# EAGLE design esp32 (EAGLE 9.6.2)

## Sheet 1 of 3: ESP32 asd
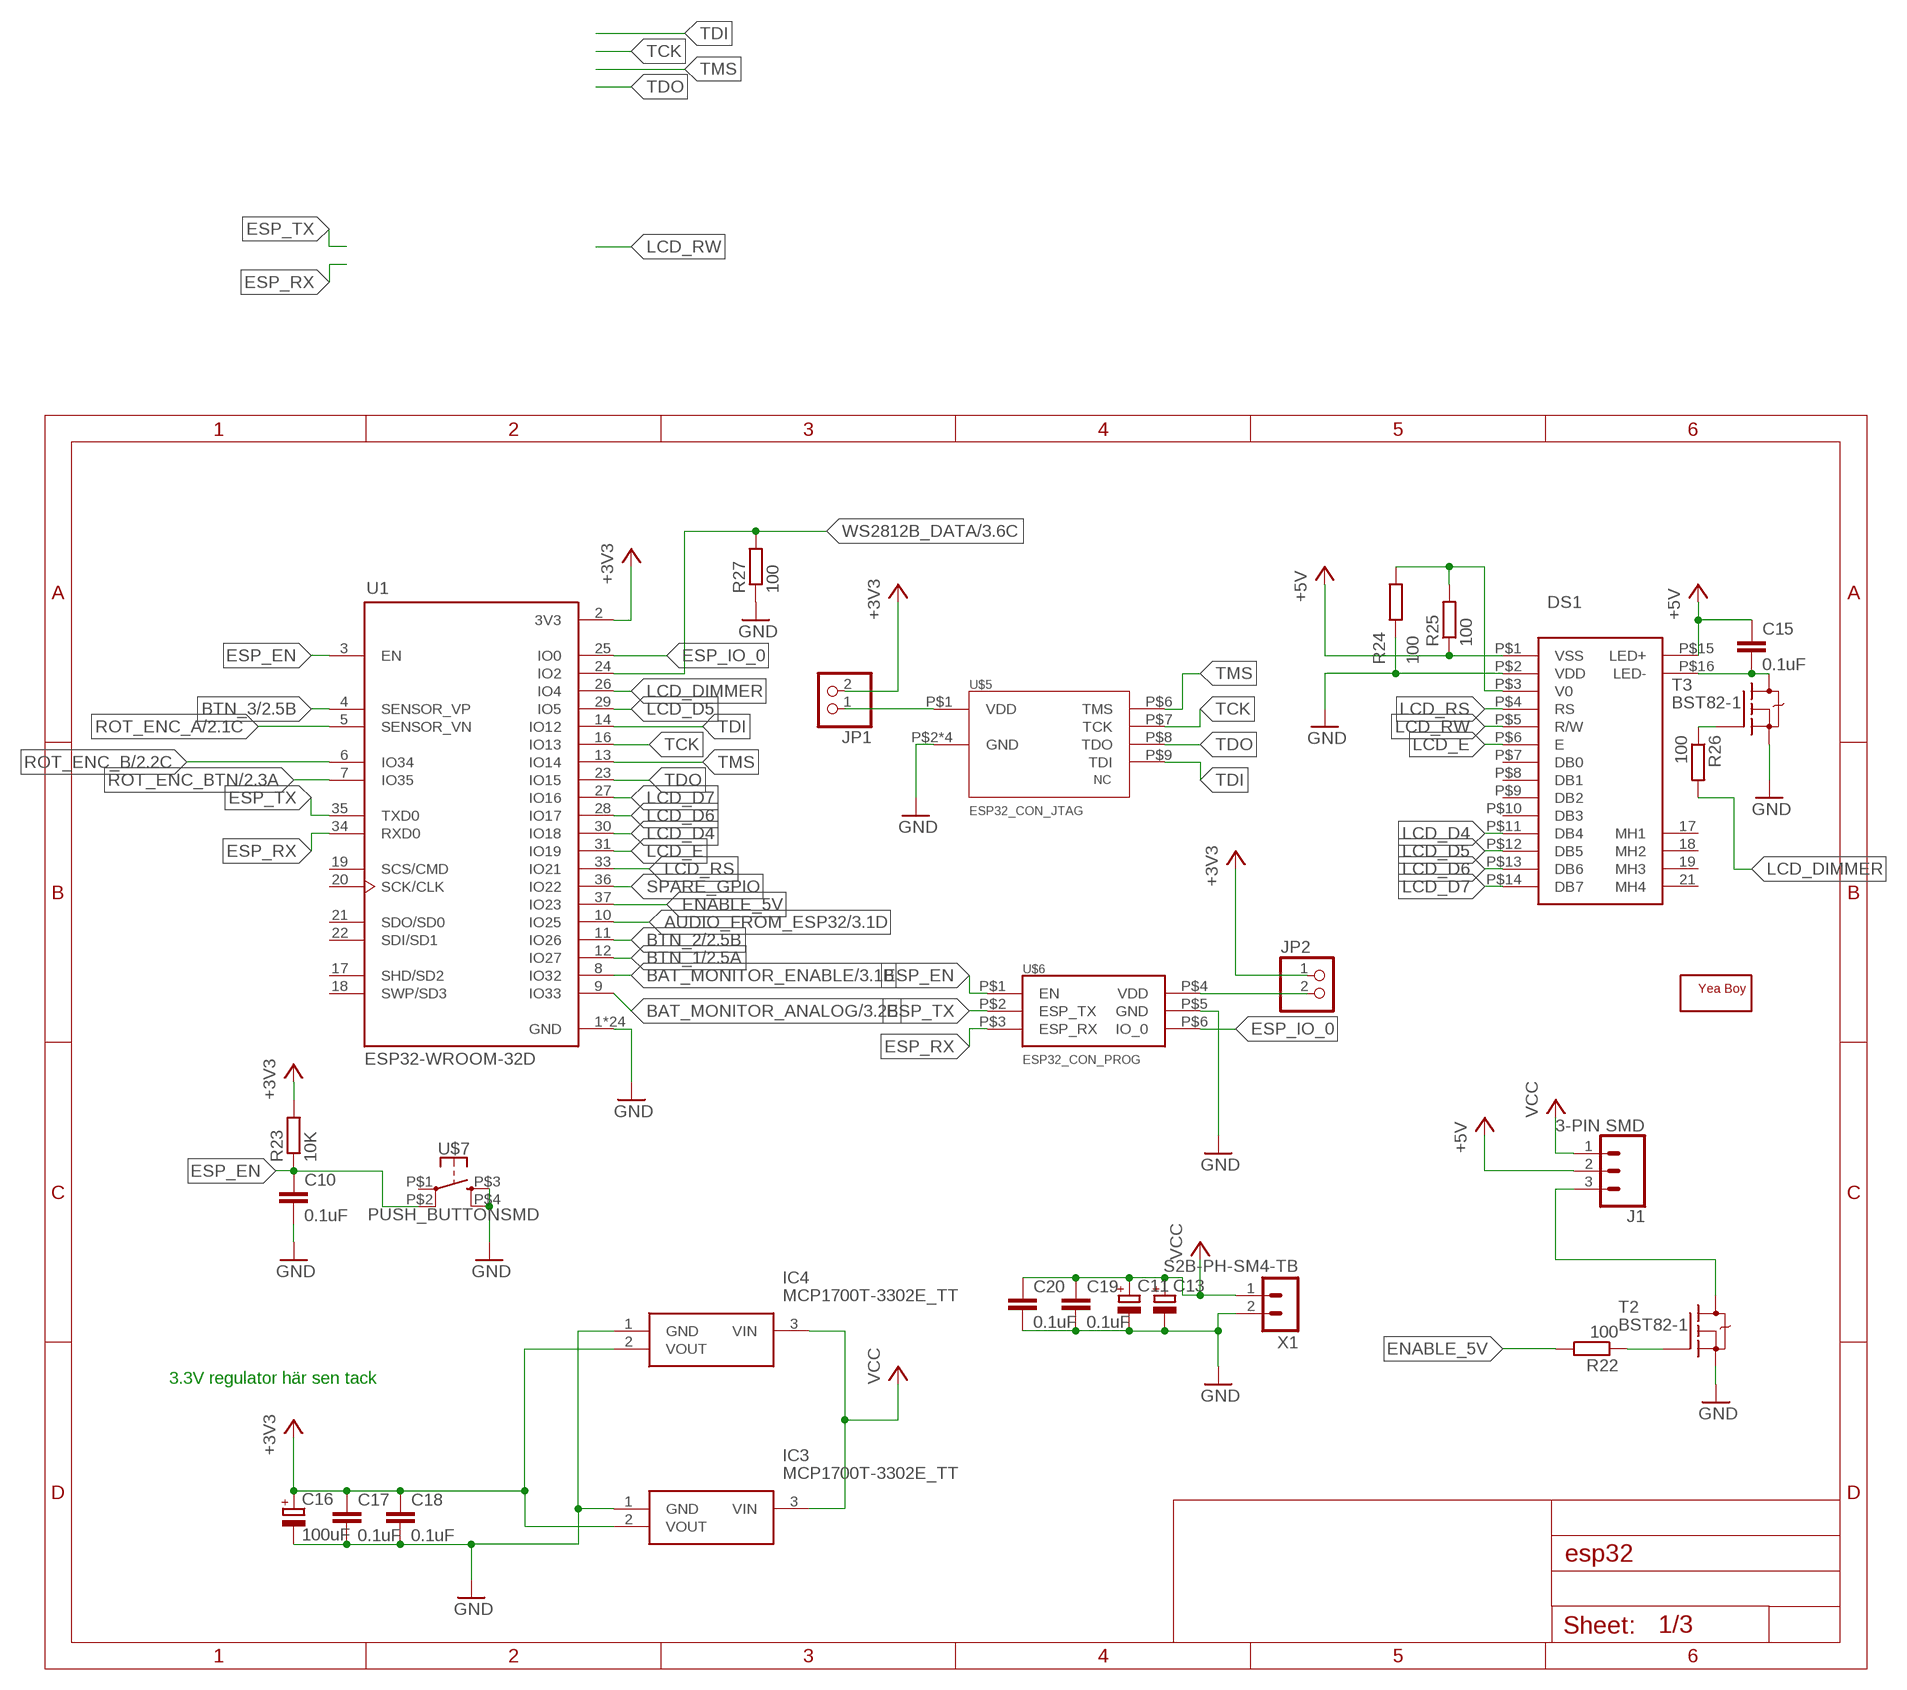
[diagram p0: schematic, sheet 1]

### Parts
C10  0.1uF  C-EUC0603  [C0603]
C11  CPOL-EU153CLV-0605  [153CLV-0605]
C13  CPOL-EU153CLV-0505  [153CLV-0505]
C15  0.1uF  C-EUC0603  [C0603]
C16  100uF  CPOL-EU153CLV-0605  [153CLV-0605]
C17  0.1uF  C-EUC0603  [C0603]
C18  0.1uF  C-EUC0603  [C0603]
C19  0.1uF  C-EUC0603  [C0603]
C20  0.1uF  C-EUC0603  [C0603]
DS1  NHD-0216XZ-FSW-GBWSMT  [NHD0216XZFSWGBW_SMT]
IC3  MCP1700T-3302E_TT  [SOT95P237X112-3N]
IC4  MCP1700T-3302E_TT  [SOT95P237X112-3N]
J1  3-PIN SMD  CONN_03JST-SMD  [JST-3-SMD]
JP1  PINHD-1X2  [1X02]
JP2  PINHD-1X2  [1X02]
R22  100  R-EU_R0603  [R0603]
R23  10K  R-EU_R0603  [R0603]
R24  100  R-EU_R0603  [R0603]
R25  100  R-EU_R0603  [R0603]
R26  100  R-EU_R0603  [R0603]
R27  100  R-EU_R0603  [R0603]
T2  BST82-1  [SOT23]
T3  BST82-1  [SOT23]
U1  ESP32-WROOM-32D  [MODULE_ESP32-WROOM-32D]
U$5  ESP32_CON_JTAG  [DC3_10P_0.05]
U$6  ESP32_CON_PROG  [DC3_6P_0.05]
U$7  PUSH_BUTTONSMD  [TACTILE_SWITCH_PTH_6.0MM_SMD]
U$8  TOUCHMARK  [TOUCHMARK]
X1  S2B-PH-SM4-TB  [S2B-PH-SM4-TB]

### Nets
+3V3: C16.+ C17.1 C18.1 IC3.2(VOUT) IC4.2(VOUT) JP1.2 JP2.1 R23.2 U1.2(3V3) ; also sheet 2
+5V: C15.1 DS1.P$1(VSS) DS1.P$15(LED+) J1.2 R25.1 ; also sheet 3
AUDIO_FROM_ESP32: U1.10(IO25) ; also sheet 3
BAT_MONITOR_ANALOG: U1.9(IO33) ; also sheet 3
BAT_MONITOR_ENABLE: U1.8(IO32) ; also sheet 3
BTN_1: U1.12(IO27) ; also sheet 2
BTN_2: U1.11(IO26) ; also sheet 2
BTN_3: U1.4(SENSOR_VP) ; also sheet 2
ENABLE_5V: R22.2 U1.37(IO23)
ESP_EN: C10.1 R23.1 U1.3(EN) U$6.P$1(EN) U$7.P$2
ESP_IO_0: U1.25(IO0) U$6.P$6(IO_0)
ESP_RX: U1.34(RXD0) U$6.P$3(ESP_RX)
ESP_TX: U1.35(TXD0) U$6.P$2(ESP_TX)
GND: C10.2 C11.- C13.- C16.- C17.2 C18.2 C19.2 C20.2 DS1.P$2(VDD) IC3.1(GND) IC4.1(GND) R24.1 R27.1 T2.2(S) T3.2(S) U1.1(GND) U1.15(GND) U1.38(GND) U1.39_1(GND) U1.39_2(GND) U1.39_3(GND) U1.39_4(GND) U1.39_5(GND) U1.39_6(GND) U1.39_7(GND) U1.39_8(GND) U1.39_9(GND) U1.39_10(GND) U1.39_11(GND) U1.39_12(GND) U1.39_13(GND) U1.39_14(GND) U1.39_15(GND) U1.39_16(GND) U1.39_17(GND) U1.39_18(GND) U1.39_19(GND) U1.39_20(GND) U1.39_21(GND) U$5.P$2(GND) U$5.P$3(GND) U$5.P$4(GND) U$5.P$5(GND) U$6.P$5(GND) U$7.P$3 U$7.P$4 X1.2 ; also sheet 2,3
LCD_D4: DS1.P$11(DB4) U1.30(IO18)
LCD_D5: DS1.P$12(DB5) U1.29(IO5)
LCD_D6: DS1.P$13(DB6) U1.28(IO17)
LCD_D7: DS1.P$14(DB7) U1.27(IO16)
LCD_DIMMER: R26.2 U1.26(IO4)
LCD_E: DS1.P$6(E) U1.31(IO19)
LCD_RS: DS1.P$4(RS) U1.33(IO21)
LCD_RW: DS1.P$5(R/W)
N$11: R22.1 T2.1(G)
N$15: J1.3 T2.3(D)
N$16: R26.1 T3.1(G)
N$17: DS1.P$3(V0) R24.2 R25.2
N$18: C15.2 DS1.P$16(LED-) T3.3(D)
N$22: JP2.2 U$6.P$4(VDD)
N$24: JP1.1 U$5.P$1(VDD)
ROT_ENC_A: U1.5(SENSOR_VN) ; also sheet 2
ROT_ENC_B: U1.6(IO34) ; also sheet 2
ROT_ENC_BTN: U1.7(IO35) ; also sheet 2
SPARE_GPIO: U1.36(IO22)
TCK: U1.16(IO13) U$5.P$7(TCK)
TDI: U1.14(IO12) U$5.P$9(TDI)
TDO: U1.23(IO15) U$5.P$8(TDO)
TMS: U1.13(IO14) U$5.P$6(TMS)
VCC: C11.+ C13.+ C19.1 C20.1 IC3.3(VIN) IC4.3(VIN) J1.1 X1.1 ; also sheet 3
WS2812B_DATA: R27.2 U1.24(IO2) ; also sheet 3
Unconnected: DS1.17(MH1) DS1.18(MH2) DS1.19(MH3) DS1.21(MH4) DS1.P$7(DB0) DS1.P$8(DB1) DS1.P$9(DB2) DS1.P$10(DB3) U1.17(SHD/SD2) U1.18(SWP/SD3) U1.19(SCS/CMD) U1.20(SCK/CLK) U1.21(SDO/SD0) U1.22(SDI/SD1) U$7.P$1

### Notes on the sheet
- 3.3V regulator här sen tack

## Sheet 2 of 3: Knappar och rotary encoder
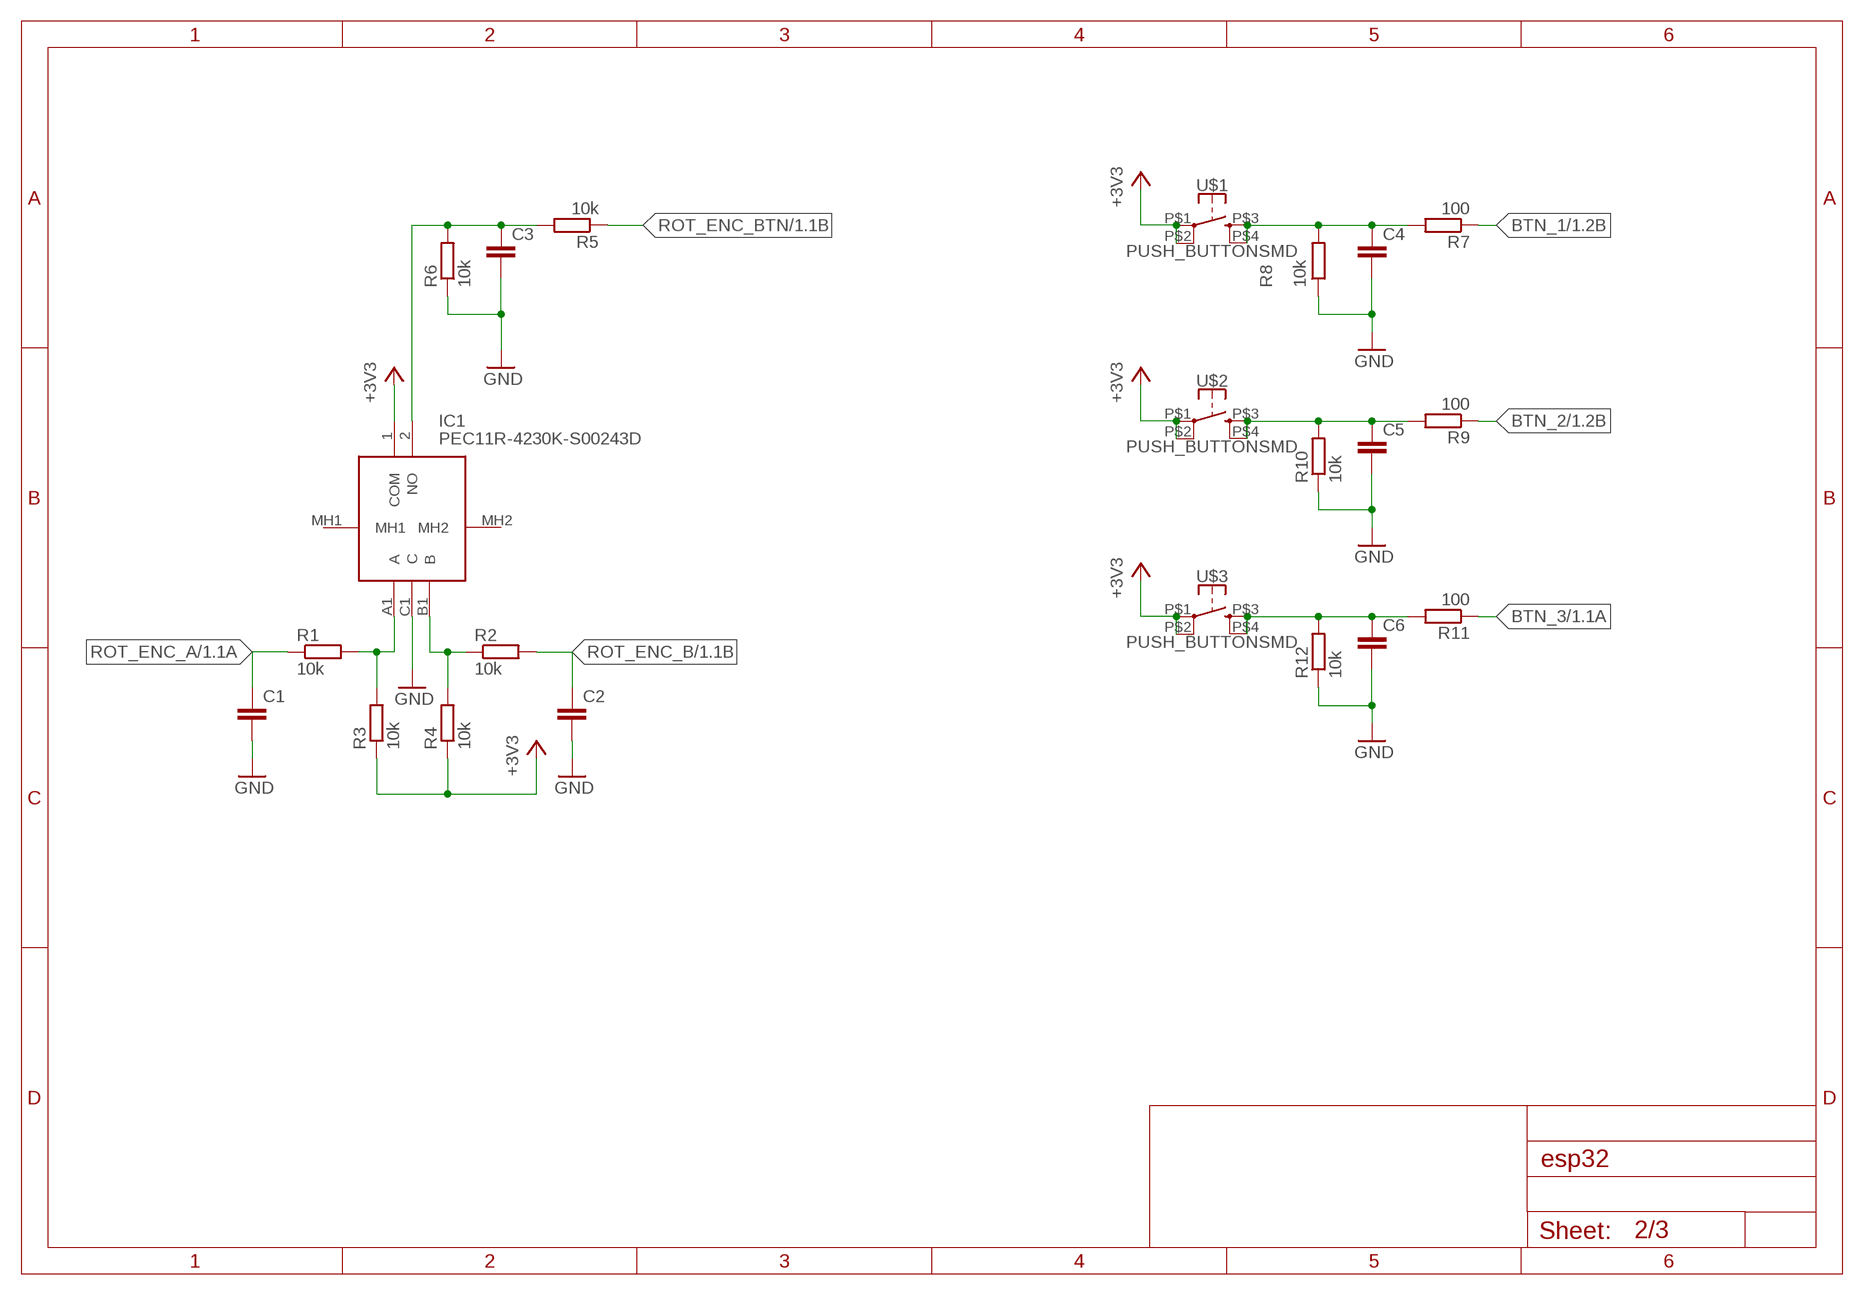
[diagram p1: schematic, sheet 2]

### Parts
C1  C-EUC0603  [C0603]
C2  C-EUC0603  [C0603]
C3  C-EUC0603  [C0603]
C4  C-EUC0603  [C0603]
C5  C-EUC0603  [C0603]
C6  C-EUC0603  [C0603]
IC1  PEC11R-4230K-S00243D  [PEC11R4230KS0024]
R1  10k  R-EU_R0603  [R0603]
R2  10k  R-EU_R0603  [R0603]
R3  10k  R-EU_R0603  [R0603]
R4  10k  R-EU_R0603  [R0603]
R5  10k  R-EU_R0603  [R0603]
R6  10k  R-EU_R0603  [R0603]
R7  100  R-EU_R0603  [R0603]
R8  10k  R-EU_R0603  [R0603]
R9  100  R-EU_R0603  [R0603]
R10  10k  R-EU_R0603  [R0603]
R11  100  R-EU_R0603  [R0603]
R12  10k  R-EU_R0603  [R0603]
U$1  PUSH_BUTTONSMD  [TACTILE_SWITCH_PTH_6.0MM_SMD]
U$2  PUSH_BUTTONSMD  [TACTILE_SWITCH_PTH_6.0MM_SMD]
U$3  PUSH_BUTTONSMD  [TACTILE_SWITCH_PTH_6.0MM_SMD]

### Nets
+3V3: IC1.1(COM) R3.1 R4.1 U$1.P$1 U$1.P$2 U$2.P$1 U$2.P$2 U$3.P$1 U$3.P$2 ; also sheet 1
BTN_1: R7.1 ; also sheet 1
BTN_2: R9.1 ; also sheet 1
BTN_3: R11.1 ; also sheet 1
GND: C1.2 C2.2 C3.2 C4.2 C5.2 C6.2 IC1.C1(C) R6.1 R8.1 R10.1 R12.1 ; also sheet 1,3
N$1: IC1.A1(A) R1.2 R3.2
N$2: IC1.B1(B) R2.1 R4.2
N$3: C4.1 R7.2 R8.2 U$1.P$3 U$1.P$4
N$6: C5.1 R9.2 R10.2 U$2.P$3 U$2.P$4
N$8: C6.1 R11.2 R12.2 U$3.P$3 U$3.P$4
N$9: C3.1 IC1.2(NO) R5.2 R6.2
ROT_ENC_A: C1.1 R1.1 ; also sheet 1
ROT_ENC_B: C2.1 R2.2 ; also sheet 1
ROT_ENC_BTN: R5.1 ; also sheet 1
Unconnected: IC1.MH1 IC1.MH2

## Sheet 3 of 3
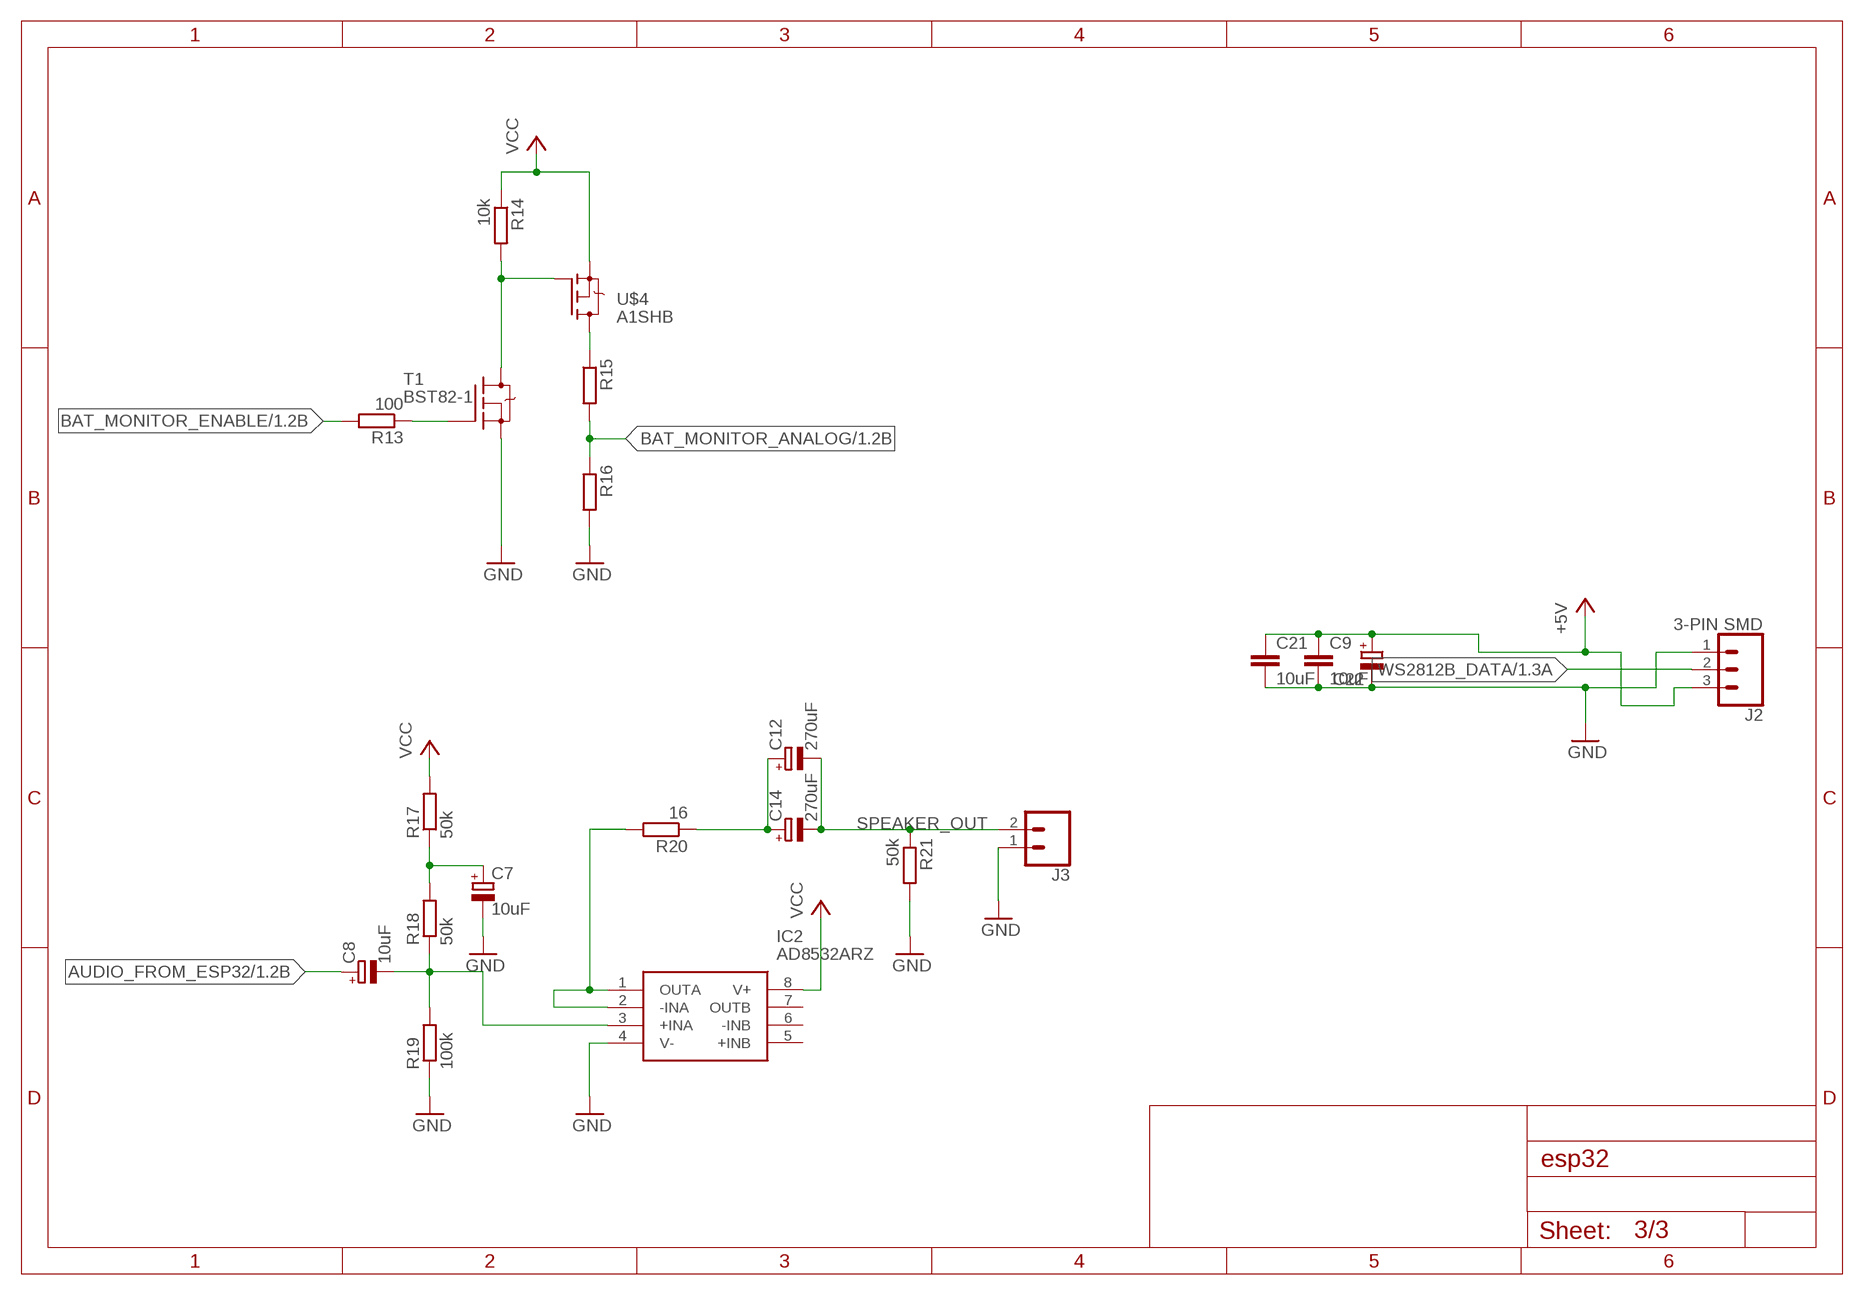
[diagram p2: schematic, sheet 3]

### Parts
C7  10uF  CPOL-EU153CLV-0505  [153CLV-0505]
C8  10uF  CPOL-EU153CLV-0505  [153CLV-0505]
C9  10uF  C-EUC0603  [C0603]
C12  270uF  CPOL-EU153CLV-0605  [153CLV-0605]
C14  270uF  CPOL-EU153CLV-0605  [153CLV-0605]
C21  10uF  C-EUC0603  [C0603]
C22  CPOL-EU153CLV-0605  [153CLV-0605]
IC2  AD8532ARZ  [SOIC127P600X175-8N]
J2  3-PIN SMD  CONN_03JST-SMD  [JST-3-SMD]
J3  CONN_02-JST-2MM-SMT  [JST-2-SMD]
R13  100  R-EU_R0603  [R0603]
R14  10k  R-EU_R0603  [R0603]
R15  R-EU_R0603  [R0603]
R16  R-EU_R0603  [R0603]
R17  50k  R-EU_R0603  [R0603]
R18  50k  R-EU_R0603  [R0603]
R19  100k  R-EU_R0603  [R0603]
R20  16  R-EU_R0603  [R0603]
R21  50k  R-EU_R0603  [R0603]
T1  BST82-1  [SOT23]
U$4  A1SHB  [SOT23]

### Nets
+5V: C9.1 C21.1 C22.+ J2.3 ; also sheet 1
AUDIO_FROM_ESP32: C8.+ ; also sheet 1
BAT_MONITOR_ANALOG: R15.2 R16.1 ; also sheet 1
BAT_MONITOR_ENABLE: R13.2 ; also sheet 1
GND: C7.- C9.2 C21.2 C22.- IC2.4(V-) J2.1 J3.1 R16.2 R19.1 R21.2 T1.2(S) ; also sheet 1,2
N$4: C8.- IC2.3(+INA) R18.1 R19.2
N$5: R15.1 U$4.3(D)
N$7: R14.2 T1.3(D) U$4.1(G)
N$10: C7.+ R17.1 R18.2
N$12: IC2.1(OUTA) IC2.2(-INA) R20.2
N$13: R13.1 T1.1(G)
N$14: C12.+ C14.+ R20.1
SPEAKER_OUT: C12.- C14.- J3.2 R21.1
VCC: IC2.8(V+) R14.1 R17.2 U$4.2(S) ; also sheet 1
WS2812B_DATA: J2.2 ; also sheet 1
Unconnected: IC2.5(+INB) IC2.6(-INB) IC2.7(OUTB)

## Library data of the parts
C1-C6 C9 C10 C15 C17-C21 = rcl:C-EU: CAPACITOR, European symbol; SPICEPREFIX: C
C7 C8 C11-C14 C16 C22 = rcl:CPOL-EU: POLARIZED CAPACITOR, European symbol; SPICEPREFIX: C
DS1 = Test:NHD-0216XZ-FSW-GBW: LCD Character Display Modules & Accessories STN- GRAY Transfl 80.0 x 36.0 Source: Datasheet
IC1 = Test:PEC11R-4230K-S0024: PEC11R Series - 12 mm Incremental Encoder Source: Datasheet
IC2 = Test:AD8532ARZ: Analog Devices AD8532ARZ, Dual Op Amp, 3MHz CMOS, Rail to Rail, 3 V, 5 V, 8-Pin SOIC Source: Datasheet; DESCRIPTION: Analog Devices AD8532ARZ, Dual Op Amp, 3MHz CMOS, Rail to Rail, 3 V, 5 V, 8-Pin SOIC; HEIGHT: 1.75mm; MANUFACTURER_NAME: Analog Devices; MANUFACTURER_PART_NUMBER: AD8532ARZ; MOUSER_PART_NUMBER: 584-AD8532ARZ; MOUSER_PRICE-STOCK: https://www.mouser.co.uk/ProductDetail/Analog-Devices/AD8532ARZ?qs=%2FtpEQrCGXCwu53p31ULFFA%3D%3D
IC3 IC4 = Test:MCP1700T-3302E_TT: LDO voltage regulator 250mA Isupply 1uA Source: Datasheet; DESCRIPTION: LDO voltage regulator 250mA Isupply 1uA; HEIGHT: 1.12mm; MANUFACTURER_NAME: Microchip; MANUFACTURER_PART_NUMBER: MCP1700T-3302E/TT; MOUSER_PART_NUMBER: 579-MCP1700T3302E/TT; MOUSER_PRICE-STOCK: https://www.mouser.co.uk/ProductDetail/Microchip-Technology/MCP1700T-3302E-TT?qs=fM4xO01eazPmCNDrdHEdaw%3D%3D
J1 J2 = SparkFun-Connectors:CONN_03: Multi connection point. Often used as Generic Header-pin footprint for 0.1 inch spaced/style header connections On any of the 0.1 inch spaced packages, you can populate with these: Break Away Headers - Straight (PRT-00116) Break Away Male Headers - Right Angle (PRT-00553) Female Headers (PRT-00115) Break Away Headers - Machine Pin (PRT-00117) Break Away Female Headers - Swiss Machine Pin (PRT-00743) Stackable Header - 3 Pin (Female, 0.1") (PRT-13875) For SCREWTERMINALS and SPRING TERMINALS visit here: Screw Terimnals on SparkFun.com (5mm/3.5mm/2.54mm spacing) This device is also useful as a general connection point to wire up your design to another part of your project. Our various solder wires solder well into these plated through hole pads. Hook-Up Wire - Assortment (Stranded, 22 AWG) (PRT-11375) Hook-Up Wire - Assortment (Solid Core, 22 AWG) (PRT-11367) View the entire wire category on our website here Special notes: Molex polarized connector foot print use with SKU : PRT-08232 with associated crimp pins and housings.; PROD_ID: CONN-12591
J3 = SparkFun-Connectors:CONN_02: Multi connection point. Often used as Generic Header-pin footprint for 0.1 inch spaced/style header connections On any of the 0.1 inch spaced packages, you can populate with these: Break Away Headers - Straight (PRT-00116) Break Away Male Headers - Right Angle (PRT-00553) Female Headers (PRT-00115) Break Away Headers - Machine Pin (PRT-00117) Break Away Female Headers - Swiss Machine Pin (PRT-00743) For SCREWTERMINALS and SPRING TERMINALS visit here: Screw Terimnals on SparkFun.com (5mm/3.5mm/2.54mm spacing) This device is also useful as a general connection point to wire up your design to another part of your project. Our various solder wires solder well into these plated through hole pads. Hook-Up Wire - Assortment (Stranded, 22 AWG) (PRT-11375) Hook-Up Wire - Assortment (Solid Core, 22 AWG) (PRT-11367) View the entire wire category on our website here Special notes: Molex polarized connector foot print use with: PRT-08233 with associated crimp pins and housings. 2.54_SCREWTERM for use with PRT-10571. 3.5mm Screw Terminal footprints for PRT-08084 5mm Screw Terminal footprints for use with PRT-08432; PROD_ID: CONN-11443
JP1 JP2 = pinhead:PINHD-1X2: PIN HEADER
R1-R27 = rcl:R-EU_: RESISTOR, European symbol; SPICEPREFIX: R
T1-T3 = Test:BST82-1
U1 = Test:ESP32-WROOM-32D: Bluetooth, WiFi 802.11b/g/n, Bluetooth v4.2 + EDR, Class 1, 2 and 3 Transceiver Module 2.4GHz ~ 2.5GHz Integrated, Trace Surface Mount; MANUFACTURER: Espressif Systems; MAXIMUM_PACKAGE_HEIGHT: 3.2 mm; PARTREV: 1.9; STANDARD: Manufacturer Recommendations
U$1-U$3 U$7 = Test:PUSH_BUTTON
U$4 = Test:A1SHB
U$5 = Test:ESP32_CON_JTAG
U$6 = Test:ESP32_CON_PROG
U$8 = Test:TOUCHMARK
X1 = con-JST PH:S2B-PH: JST PH series header 2.00mm pitch disconnectable crimp style connectors, horizontal (side entry type), 2 pins

## Board
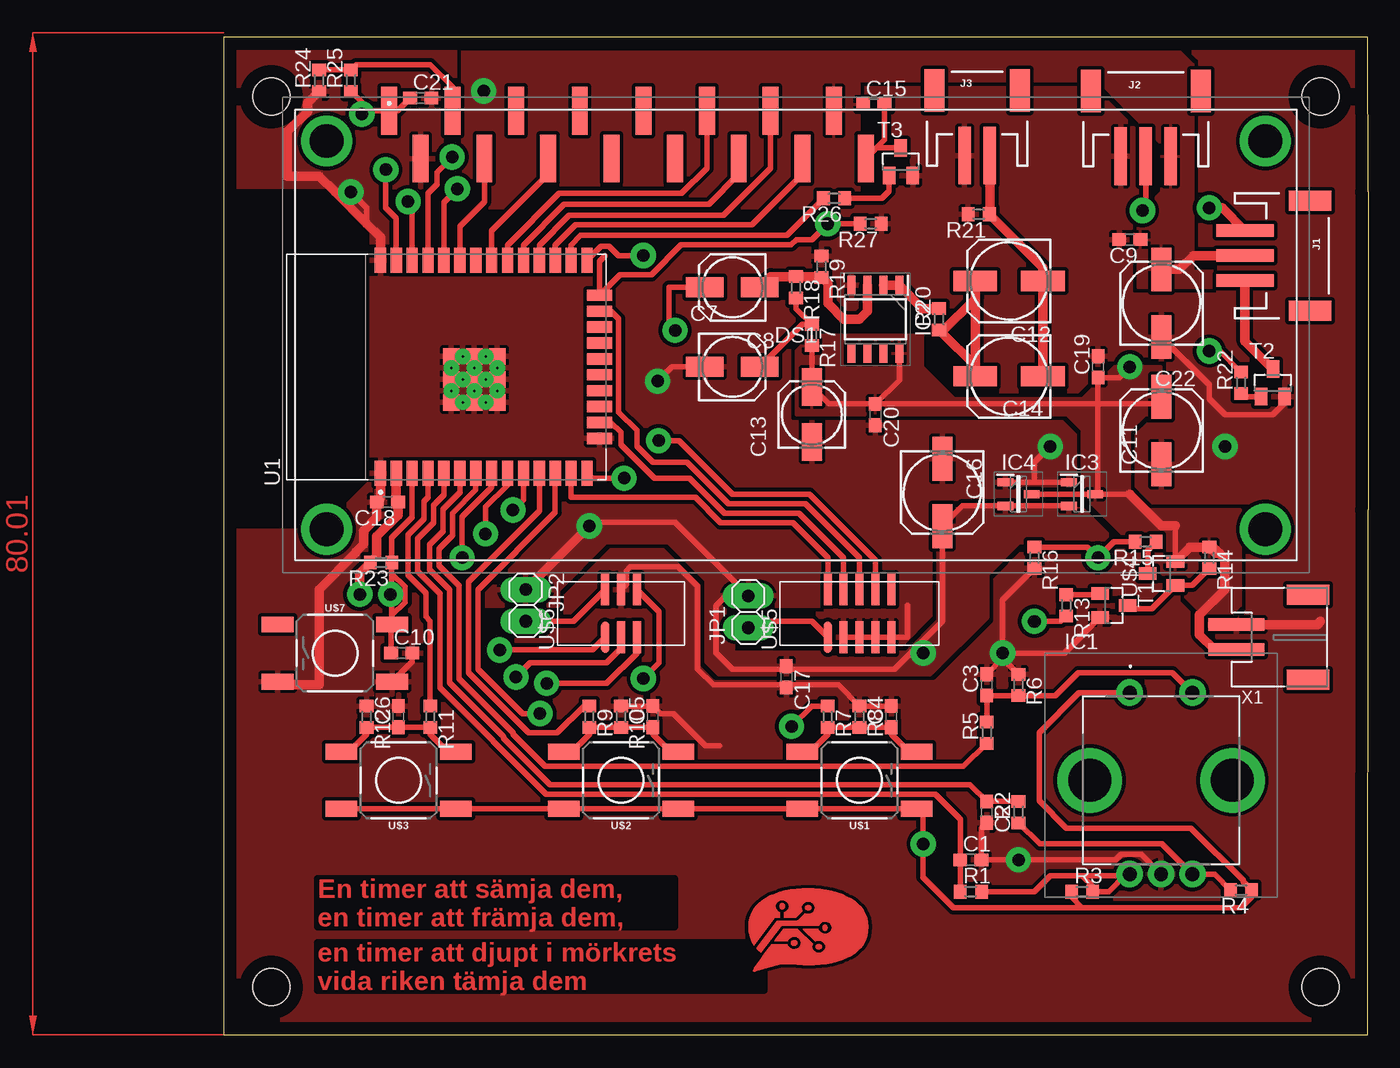
[diagram p3: board, top side]
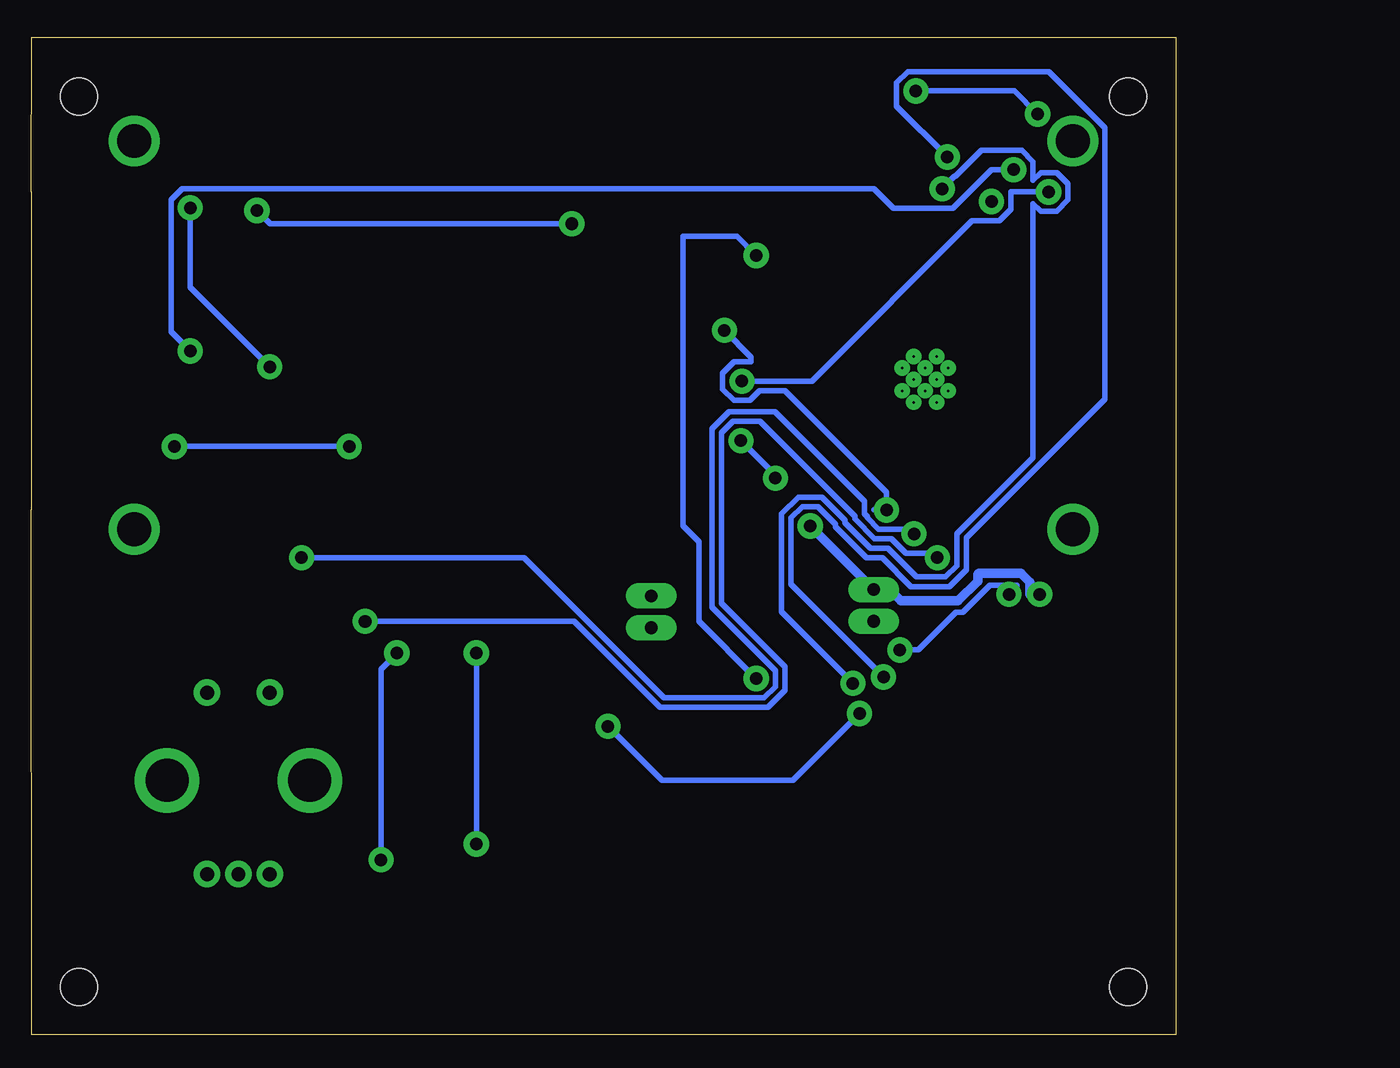
[diagram p4: board, bottom side, seen from below]

Size 91.44 x 79.68 mm. Coordinates in mm from the lower left corner, seen from the top.
Outline: 0,0 91.42,0 91.44,41.91 91.44,67.31 91.42,79.68 0,79.68 0,0
Copper layers (1*16): Top 0.035mm / dielectric 1.5mm / Bottom 0.035mm
Design rules "default *": minimum track width 18mil, minimum drill 1mm, track to track 12mil, track to pad 12mil, pad to pad 12mil, via to via 12mil, smd to smd 12mil, copper to edge 40mil, drill to drill 6mil, minimum pad ring 20mil, minimum via ring 20mil, stop-mask expansion 4mil, vias tented up to drill 0mil, thermal gap 10mil
Holes 3 mm at 3.81,74.93 87.63,74.93 87.63,3.81 3.81,3.81

### Footprints (pad centres in the part's own frame; a part is rotated, then mirrored left to right if it is on the bottom)
C0603 = smd 1.1 x 1: 1 -0.85,0; 2 0.85,0
153CLV-0505 = smd 3 x 1.6: + 2.2,0; - -2.2,0
153CLV-0605 = smd 3.5 x 1.6: + 2.7,0; - -2.7,0
NHD0216XZFSWGBW_SMT = drill 2.7 pad 4.05: 17 -37.5,-15.5; 18 37.5,-15.5; 19 37.5,15.5; 21 -37.5,15.5 | smd 1.27 x 3.81: P$1 -32.512,17.907; P$2 -29.972,14.097; P$3 -27.432,17.907; P$4 -24.892,14.097; P$5 -22.352,17.907; P$6 -19.812,14.097; P$7 -17.272,17.907; P$8 -14.732,14.097; P$9 -12.192,17.907; P$10 -9.652,14.097; P$11 -7.112,17.907; P$12 -4.572,14.097; P$13 -2.032,17.907; P$14 0.508,14.097; P$15 3.048,17.907; P$16 5.588,14.097
PEC11R4230KS0024 = drill 1.1 pad 1.65: 1 0,7; 2 5,7; A1 0,-7.5; B1 5,-7.5; C1 2.5,-7.5 | drill 3.441 pad 5.161: MH1 -3.2,0; MH2 8.2,0
SOIC127P600X175-8N = smd 1.525 x 0.65: 1 -2.712,1.905; 2 -2.712,0.635; 3 -2.712,-0.635; 4 -2.712,-1.905; 5 2.712,-1.905; 6 2.712,-0.635; 7 2.712,0.635; 8 2.712,1.905
SOT95P237X112-3N = smd 1.25 x 0.65: 1 -1.05,0.95; 2 -1.05,-0.95; 3 1.05,0
JST-3-SMD = smd 1 x 4.6: 1 -1.99,-4.77; 2 0.01,-4.77; 3 2.01,-4.77 | smd 1.6 x 3.4: NC1 -4.39,0.43; NC2 4.41,0.43
JST-2-SMD = smd 1 x 4.6: 1 -1,-3.7; 2 1,-3.7 | smd 1.6 x 3.4: NC1 -3.4,1.5; NC2 3.4,1.5
1X02 = drill 1.016 long: 1 -1.27,0; 2 1.27,0
R0603 = smd 1 x 1.1: 1 -0.85,0; 2 0.85,0
SOT23 = smd 1 x 1.4: 1 -0.95,-1.1; 2 0.95,-1.1; 3 0,1.1
MODULE_ESP32-WROOM-32D = smd 2 x 0.9: 1 -8.5,5.26; 2 -8.5,3.99; 3 -8.5,2.72; 4 -8.5,1.45; 5 -8.5,0.18; 6 -8.5,-1.09; 7 -8.5,-2.36; 8 -8.5,-3.63; 9 -8.5,-4.9; 10 -8.5,-6.17; 11 -8.5,-7.44; 12 -8.5,-8.71; 13 -8.5,-9.98; 14 -8.5,-11.25; 25 8.5,-11.25; 26 8.5,-9.98; 27 8.5,-8.71; 28 8.5,-7.44; 29 8.5,-6.17; 30 8.5,-4.9; 31 8.5,-3.63; 32 8.5,-2.36; 33 8.5,-1.09; 34 8.5,0.18; 35 8.5,1.45; 36 8.5,2.72; 37 8.5,3.99; 38 8.5,5.26 | smd 0.9 x 2: 15 -5.715,-12.25; 16 -4.445,-12.25; 17 -3.175,-12.25; 18 -1.905,-12.25; 19 -0.635,-12.25; 20 0.635,-12.25; 21 1.905,-12.25; 22 3.175,-12.25; 23 4.445,-12.25; 24 5.715,-12.25 | smd 1.33 x 1.33: 39_1 -2.835,-0.405; 39_2 -1,-0.405; 39_3 0.835,-0.405; 39_4 -2.835,-2.24; 39_5 -1,-2.24; 39_6 0.835,-2.24; 39_7 -2.835,-4.075; 39_8 -1,-4.075; 39_9 0.835,-4.075 | drill 0.2 pad 0.3: 39_10 -1.917,-0.405; 39_11 -0.083,-0.405; 39_12 -2.835,-1.323; 39_13 -1,-1.323; 39_14 0.835,-1.323; 39_15 -1.917,-2.24; 39_16 -0.083,-2.24; 39_17 -2.835,-3.158; 39_18 -1,-3.158; 39_19 0.835,-3.158; 39_20 -1.917,-4.075; 39_21 -0.083,-4.075
TACTILE_SWITCH_PTH_6.0MM_SMD = smd 2.54 x 1.27: P$1 -4.572,2.286; P$2 4.572,2.286; P$3 -4.572,-2.286; P$4 4.572,-2.286
DC3_10P_0.05 = smd 2.54 x 0.635: P$1 0,0; P$2 0,-1.27; P$3 0,-2.54; P$4 0,-3.81; P$5 0,-5.08; P$6 3.81,0; P$7 3.81,-1.27; P$8 3.81,-2.54; P$9 3.81,-3.81; P$10 3.81,-5.08
DC3_6P_0.05 = smd 2.54 x 0.635: P$1 0,0; P$2 0,-1.27; P$3 0,-2.54; P$4 3.81,0; P$5 3.81,-1.27; P$6 3.81,-2.54
S2B-PH-SM4-TB = smd 1 x 4.5: 1 1,0; 2 -1,0 | smd 1.6 x 3.4: M1 3.4,5.75; M2 -3.4,5.75

### Placement (x,y rotation side)
C1  59.69,13.97 0 top
C2  60.96,17.78 270 top
C3  60.96,27.94 90 top
C4  53.34,25.4 90 top
C5  34.29,25.4 90 top
C6  13.97,25.4 90 top
C7  40.64,53.34 0 top
C8  40.64,59.69 180 top
C9  72.39,63.5 180 top
C10  14.22,30.48 0 top
C11  74.93,48.26 90 top
C12  62.74,60.2 180 top
C13  46.99,49.53 90 top
C14  62.74,52.58 180 top
C15  51.94,74.3 0 top
C16  57.4,43.31 270 top
C17  44.96,28.57 270 top
C18  13.08,42.55 180 top
C19  69.85,53.34 90 top
C20  52.07,49.53 270 top
C21  15.75,74.8 0 top
C22  74.93,58.42 90 top
DS1  45.72,55.88 0 top
IC1  72.39,20.32 0 top
IC2  52.07,57.15 270 top
IC3  68.58,43.18 0 top
IC4  63.5,43.18 0 top
J1  86.36,62.23 270 top
J2  73.66,74.93 0 top
J3  60.2,73.91 0 top
JP1  41.91,33.78 90 top
JP2  24.13,34.29 270 top
R1  59.69,11.43 0 top
R2  63.5,17.78 90 top
R3  68.58,11.43 0 top
R4  81.28,11.56 180 top
R5  60.96,24.13 90 top
R6  63.5,27.94 270 top
R7  48.26,25.4 270 top
R8  50.8,25.4 270 top
R9  29.21,25.4 270 top
R10  31.75,25.4 270 top
R11  16.51,25.4 270 top
R12  11.43,25.4 270 top
R13  67.31,34.29 270 top
R14  78.74,38.1 270 top
R15  73.66,39.37 180 top
R16  64.77,38.1 270 top
R17  46.99,55.88 270 top
R18  45.72,59.69 270 top
R19  47.75,61.34 270 top
R20  57.15,57.15 90 top
R21  60.33,65.53 180 top
R22  81.28,52.07 90 top
R23  12.57,37.72 180 top
R24  7.62,76.2 90 top
R25  10.16,76.2 90 top
R26  48.77,66.8 180 top
R27  51.69,64.77 180 top
T1  71.12,34.29 270 top
T2  83.82,52.07 0 top
T3  54.1,69.72 0 top
U1  17.78,53.34 90 top
U$1  50.8,20.32 180 top
U$2  31.75,20.32 180 top
U$3  13.97,20.32 180 top
U$4  74.93,36.83 90 top
U$5  48.26,31.75 90 top
U$6  30.48,31.75 90 top
U$7  8.89,30.48 0 top
U$8  41.91,5.08 0 top
X1  80.9,31.75 270 top

### Tracks (layer width: path | path; a pad name or v marks a point on that pad's centre or on a via)
+3V3  (via drill 1)
  Top 0.457: U$3.P$2 U$3.P$1 U$2.P$2 U$2.P$1 U$1.P$2 U$1.P$1 55.88,17.53 v55.88,15.24 55.88,12.59 58.31,10.16 68.58,10.16 | 68.58,10.16 81.28,10.16 82.13,11.01 R4.1 81.46,12.22 81.46,12.33 77.28,16.51 67.31,16.51 65.15,18.67 65.15,24.13 68.34,27.32 IC1.1 | 68.58,10.16 67.73,11.01 R3.1 | IC3.2 IC4.2 59.03,42.23 C16.+ 57.4,33.02 54.86,30.48 | 54.86,30.48 v55.88,30.48 | JP2.1 29.48,40.91 36.05,40.91 JP1.2 40.13,35.05 39.34,34.27 39.34,30.5 40.64,29.21 44.74,29.21 C17.1 45.17,29.21 53.59,29.21 54.86,30.48
  Top 0.762: v29.21,40.64 JP2.1 | v10.88,35.18 10.88,36.87 R23.2 12.24,38.23 12.24,39.82 13.93,41.51 C18.1 13.79,42.69 U1.2
  Bottom 0.457: v55.88,30.48 v55.88,15.24
  Bottom 0.762: v29.21,40.64 JP2.1 23.75,35.18 22.48,35.18 21.94,34.65 17.4,34.65 15.83,36.22 15.83,36.77 15.73,36.87 12.36,36.87 11.64,36.15 11.64,35.18 v10.88,35.18
  pour Top: 57.15,41.91 57.15,33.02 54.61,30.48 40.64,30.48 40.64,34.29 49.53,34.29 49.53,38.1 44.45,43.18 26.67,43.18 20.32,36.83 20.32,34.29 26.67,34.29 26.67,35.56 30.48,39.37 35.56,39.37 38.61,36.32 38.61,29.84 39.62,28.83 56.39,28.83 60.96,33.4 60.96,36.83 63.5,39.37 71.12,39.37 68.58,41.91
+5V  (via drill 1)
  Top 0.457: R25.1 11.05,74.46 v11.05,73.53 11.3,73.79 DS1.P$1 13.88,73.79 C21.1
  Top 0.762: J1.2 77.46,62.22 76.36,61.12 C22.+
  Bottom 0.457: v11.05,73.53 12.89,75.38 v20.77,75.38
  pour Top: 19.05,78.74 19.05,66.04 50.8,66.04 50.8,76.2 69.85,76.2 74.93,71.12 74.93,67.31 73.03,65.41 73.03,59.69 83.82,59.69 83.82,60.96 77.47,60.96 77.47,77.47 76.2,78.74
AUDIO_FROM_ESP32  (via drill 1)
  Top 0.457: U1.10 23.95,42.75 v23.11,41.91 | v36.07,56.26 35.56,56.77 35.56,59.69 C8.+
  Bottom 0.457: 24.13,41.91 v23.11,41.91 23.11,43.31 31.24,51.44 33.25,51.44 34.03,50.66 35.31,50.66 36.21,51.56 36.21,52.84 35.31,53.74 33.94,53.74 33.94,54.13 v36.07,56.26
BAT_MONITOR_ANALOG  (via drill 1)
  Top 0.457: v20.92,40.01 20.94,40.02 20.94,42.16 22.68,43.91 U1.9 | R16.1 69,38.95 v69.85,38.1 71.12,39.37 R15.2
  Bottom 0.457: v69.85,38.1 52.07,38.1 40.88,26.91 32.89,26.91 31.99,27.81 31.99,29.09 37.05,34.15 37.05,48.4 35.7,49.75 32.03,49.75 24.89,42.61 24.89,41.59 24.66,41.36 24.66,41.27 23.75,40.37 21.28,40.37 v20.92,40.01
BAT_MONITOR_ENABLE  (via drill 1)
  Top 0.457: v64.77,33.02 66.89,33.02 R13.2 | U1.8 21.41,43.71 19.05,41.35 v19.05,38.1
  Bottom 0.457: v64.77,33.02 48.07,33.02 41.19,26.14 32.57,26.14 31.23,27.49 31.23,29.4 36.29,34.46 36.29,48.08 35.38,48.99 33.22,48.99 25.65,41.42 25.65,41.19 24.07,39.61 22.7,39.61 21.56,38.46 19.41,38.46 v19.05,38.1
BTN_1  (via drill 1)
  Top 0.457: R7.1 46.99,26.25 v45.37,24.63 | v25.27,25.65 23.88,25.65 20.32,29.21 20.32,35.56 26.49,41.73 U1.12
  Bottom 0.457: v45.37,24.63 41.06,20.32 30.61,20.32 v25.27,25.65
BTN_2
  Top 0.457: R9.1 28.78,26.25 26.65,24.11 24.34,24.11 19.56,28.89 19.56,36.17 25.22,41.84 U1.11
BTN_3
  Top 0.457: R11.1 16.51,33.02 16.16,33.37 16.16,35.27 14.73,36.7 14.73,39.94 16,41.21 16,42.62 16.33,42.94 U1.4
ENABLE_5V  (via drill 1)
  Top 0.457: v78.74,54.61 79.59,54.61 R22.2 | v12.95,69.09 12.95,66.04 13.79,65.2 U1.37
  Bottom 0.457: v12.95,69.09 14.73,69.09 17.8,66.02 22.57,66.02 24.13,67.58 79.38,67.58 80.28,66.68 80.28,56.15 v78.74,54.61
ESP_EN  (via drill 1)
  Top 0.457: C10.1 13.37,32.68 U$7.P$2 13.42,32.8 13.42,33.49 | 13.42,36.83 R23.1 13.42,39.71 15.06,41.34 U1.3 | 13.42,36.83 13.42,35.27 v13.34,35.18 13.42,35.09 13.42,33.49 | U$6.P$1 29.46,30.73 v22.05,30.73 | 13.42,36.83 14.48,35.77 14.48,34.54 13.42,33.49
  Bottom 0.457: v22.05,30.73 20.57,30.73 17.58,33.73 17.02,33.73 14.84,35.92 12.7,35.92 12.7,35.81 v13.34,35.18
ESP_IO_0  (via drill 1)
  Top 0.457: U$6.P$6 34.8,33.78 34.8,29.72 v33.53,28.45 | U1.25 30.16,62.99 30.8,62.99 31.56,62.23 v33.53,62.23
  Bottom 0.457: v33.53,62.23 35.07,63.77 39.37,63.77 39.37,40.64 38.1,39.37 38.1,33.02 v33.53,28.45
ESP_RX  (via drill 1)
  Top 0.457: v25.8,28.07 30.61,28.07 33.02,30.48 U$6.P$3 | U1.34 17.6,66.5 v18.67,67.56
  Bottom 0.457: v18.67,67.56 17.67,68.56 17.61,68.56 15.55,70.63 12.32,70.63 11.41,69.73 11.41,68.24 10.8,68.85 9.52,68.85 8.62,67.95 8.62,66.67 9.52,65.77 10.8,65.77 11.41,66.38 11.41,46.1 17.51,40 17.51,37.46 18.41,36.56 20.73,36.56 23.02,38.84 24.38,38.84 26.42,40.88 26.42,41.1 28.26,42.94 30.16,42.94 31.51,41.59 31.51,33.78 v25.8,28.07
ESP_TX  (via drill 1)
  Top 0.457: U$6.P$2 31.75,30.86 30.61,29.72 24.5,29.72 v23.35,28.57 | U1.35 16.33,67.22 17.03,67.93 17.03,68.89 v18.25,70.1
  Bottom 0.457: v18.25,70.1 22.31,74.16 22.31,76.02 21.41,76.92 10.14,76.92 5.66,72.44 5.66,50.77 16.75,39.69 16.75,37.15 18.1,35.8 21.16,35.8 23.45,38.08 24.7,38.08 27.18,40.56 27.18,40.79 28.57,42.18 29.85,42.18 30.75,41.28 30.75,35.98 v23.35,28.57
GND  (via drill 1)
  Top 0.457: C10.2 15.07,29.81 U$7.P$4 | IC1.C1 73.3,14.41 71.73,14.41 71.29,13.97 v63.5,13.97 C1.2 60.54,16.51 C2.2 | C22.- 78.74,51.91 78.74,50.8 80.01,49.53 83.82,49.53 84.77,50.48 T2.2 | C4.2 R8.1 49.11,27.94 39.12,27.94 37.85,29.21 37.85,35.81 36.3,37.36 32.48,37.36 32.17,37.05 32.17,35.98 U$6.P$5 | R10.1 C5.2 34.91,25.63 35.95,25.63 38.5,23.09 39.6,23.09 | IC3.1 64.77,44.13 | 64.77,44.13 IC4.1 | v62.23,30.48 67.16,30.48 T1.2 | R6.1 62.23,30.06 | C3.2 62.23,30.06 | 62.23,30.06 v62.23,30.48 | v62.23,30.48 62.23,34.71 R16.2 | 64.77,44.13 64.77,45.72 v66.04,46.99 | U$5.P$2 U$5.P$3 U$5.P$4 U$5.P$5 54.61,31.75 54.61,34.29 | 11.43,64.77 11.43,66.04 v10.16,67.31 | v34.67,52.2 35.81,53.34 C7.-
  Top 0.762: X1.2 87.36,32.75 87.63,33.02 | U$7.P$3 4.57,27.94 7.62,27.94 7.62,35.56 10.54,38.48 10.54,38.55 11.17,39.19 11.17,40.26 12.23,41.32 C18.2 12.52,42.83 U1.1 | U1.38 12.52,63.68 11.43,64.77 8.89,67.31 7.62,68.58 5.08,68.58 5.08,72.1 6.71,73.73 6.71,74.44 R24.1
  Bottom 0.457: v63.5,13.97 63.5,29.21 v62.23,30.48 | v66.04,46.99 v80.01,46.99 | v10.16,67.31 13.19,67.31 13.19,65.91 14.09,65.01 16.27,65.01 29.08,52.2 v34.67,52.2
  pour Top (rank 6): 0,80.01 0,0 91.44,0 91.44,80.01
  cutout Top (rank 2): 11.43,64.77 8.89,67.31 -1.27,67.31 -1.27,40.64 7.62,40.64 11.43,44.45
  pour Top: 5.71,12.95 5.71,1.52 38.73,1.52 38.73,12.95
LCD_D4
  Top 0.457: DS1.P$11 38.61,69.22 36.59,67.2 26.81,67.2 22.68,63.07 U1.30
LCD_D5
  Top 0.457: DS1.P$12 41.15,68.71 38.77,66.33 27.21,66.33 23.95,63.07 U1.29
LCD_D6
  Top 0.457: DS1.P$13 43.69,69.22 39.92,65.46 27.61,65.46 25.22,63.07 U1.28
LCD_D7
  Top 0.457: DS1.P$14 46.23,68.71 42.21,64.69 28.11,64.69 26.49,63.07 U1.27
LCD_DIMMER
  Top 0.457: R26.2 47.92,66.75 45.01,63.84 28.53,63.84 27.76,63.07 U1.26
LCD_E
  Top 0.457: DS1.P$6 25.91,68.71 21.41,64.21 U1.31
LCD_RS
  Top 0.457: DS1.P$4 20.83,66.53 18.87,64.57 U1.33
N$1
  Top 0.457: 68.58,12.7 66.04,12.7 64.77,11.43 R1.2 | 68.58,12.7 69.43,11.85 R3.2 70.7,11.43 72.09,12.82 IC1.A1 72.27,12.7 68.58,12.7
N$2
  Top 0.457: R4.2 79.17,12.82 IC1.B1 74.97,15.24 65.19,15.24 R2.1
N$3
  Top 0.457: U$1.P$4 46.86,22.61 48.26,24 R7.2 R8.2 C4.1 53.34,24 54.74,22.61 U$1.P$3
N$4
  Top 0.762: C8.- 43.69,60.54 R18.1 47.7,60.54 R19.2 48.26,59.98 48.26,58.42 49.53,57.15 50.8,57.15 51.44,57.78 IC2.3
N$5
  Top 0.457: R15.1 73.83,38.69 U$4.3
N$6
  Top 0.457: U$2.P$4 27.81,22.61 29.21,24 R9.2 R10.2 C5.1 34.29,24 35.69,22.61 U$2.P$3
N$7
  Top 0.457: R14.2 77.37,35.88 U$4.1 74.16,34.01 72.5,34.01 T1.3
N$8
  Top 0.457: U$3.P$4 10.03,22.61 11.43,24 R12.2 C6.1 R11.2 16.51,24 17.91,22.61 U$3.P$3
N$9
  Top 0.457: R5.2 C3.1 R6.2 66.46,27.09 68.28,28.91 75.8,28.91 IC1.2
N$10
  Top 0.457: C7.+ 46.23,56.73 R17.1 45.72,58 R18.2
N$11
  Top 0.457: T2.1 81.53,50.97 R22.1
N$12
  Top 0.762: R20.2 55.84,58 IC2.1 IC2.2
N$13
  Top 0.457: T1.1 69.92,35.14 R13.1
N$14
  Top 0.762: R20.1 57.36,56.09 | 57.36,56.09 60.04,53.41 C14.+ C12.+ 60.04,58.77 57.36,56.09
N$15
  Top 0.762: T2.3 81.59,55.4 J1.3
N$16
  Top 0.457: R26.1 52.6,66.8 53.15,67.35 T3.1
N$17
  Top 0.457: R24.2 R25.2 10.58,77.47 16.51,77.47 18.29,75.69 DS1.P$3
N$18
  Top 0.457: T3.3 52.15,70.82 DS1.P$16 52.79,71.46 C15.2
N$22
  Top 0.457: U$6.P$4 27.94,33.02 JP2.2
N$24
  Top 0.457: U$5.P$1 46.99,33.02 42.42,33.02 JP1.1
ROT_ENC_A
  Top 0.457: R1.1 C1.1 58.84,17.23 56.86,19.2 25.77,19.2 17.27,27.7 17.27,35.23 15.49,37.01 15.49,38.1 15.49,39.62 16.76,40.89 16.76,42.3 17.6,43.14 U1.5
ROT_ENC_B
  Top 0.457: R2.2 C2.1 59.63,19.96 26.08,19.96 22.35,23.7 22.35,23.81 18.03,28.13 18.03,35.55 16.46,37.12 16.46,39.12 17.53,40.19 17.53,41.98 18.87,43.33 U1.6
ROT_ENC_BTN
  Top 0.457: R5.1 59.12,21.44 25.69,21.44 23.11,24.01 23.11,24.13 18.8,28.45 18.8,35.86 17.22,37.44 17.22,38.81 18.29,39.88 18.29,41.67 20.14,43.52 U1.7
SPARE_GPIO  (via drill 1)
  Top 0.457: v14.73,66.55 15.06,66.22 U1.36
SPEAKER_OUT
  Top 0.762: J3.2 61.2,65.56 R21.1 65.44,61.27 C12.- C14.-
TCK
  Top 0.457: U$5.P$7 49.53,38.1 45.97,41.66 40.01,41.66 37.22,44.45 34.42,44.45 31.75,47.12 31.75,48.11 30.96,48.9 U1.16
TDI  (via drill 1)
  Top 0.457: v31.99,44.45 29.42,44.45 U1.14 | U$5.P$9 52.07,37.91 46.8,43.18 40.64,43.18 36.38,47.45 v34.74,47.45
  Bottom 0.457: v34.74,47.45 31.99,44.69 v31.99,44.45
TDO
  Top 0.457: U$5.P$8 50.8,38.1 46.48,42.42 40.32,42.42 37.02,45.72 34.29,45.72 33.02,46.99 33.02,48.26 31.56,49.72 31.56,57.19 30.96,57.78 U1.23
TMS
  Top 0.457: U1.13 27.76,42.91 37.68,42.91 39.69,40.89 45.47,40.89 48.26,38.1 U$5.P$6
VCC  (via drill 1)
  Top 0.457: R17.2 C13.+ 48.34,50.38 C20.1 | C20.1 53.98,52.28 IC2.8 | IC4.3 IC3.3 | C20.1 69.85,50.38 | 69.85,50.38 74.35,50.38 C11.+ | IC3.3 69.85,43.4 69.85,50.38 | 76.03,40.64 U$4.2 | IC3.3 72.39,43.18 | 69.85,50.38 C19.1 71.54,52.49 v72.39,53.34
  Top 0.762: v78.74,66.04 79.77,66.04 J1.1 | U$4.2 77.2,38.95 R14.1 | R14.1 79.25,38.44 79.57,38.44 | 72.39,43.18 74.93,40.64 76.03,40.64 | X1.1 79.18,30.75 77.96,31.97 77.96,33.53 79.98,35.55 79.98,38.03 79.06,38.95 R14.1
  Bottom 0.457: v78.74,66.04 78.74,59.69 v72.39,53.34
  pour Top: 81.28,34.29 81.28,41.91 73.66,41.91 72.39,43.18 72.39,48.26 73.66,49.53 74.93,49.53 74.93,53.34 71.12,53.34 68.58,50.8 58.42,50.8 55.88,53.34 55.88,55.88 46.99,55.88 45.72,54.61 45.72,49.53 67.31,49.53 68.58,48.26 68.58,43.18 79.38,32.38
WS2812B_DATA  (via drill 1)
  Top 0.457: J2.2 73.67,66.08 v73.41,65.82 | 30.48,62.23 30.03,61.78 U1.24 31.66,60.69 34.17,60.69 36.55,63.08 45.32,63.08 45.74,63.5 46.99,63.5 v48.26,64.77 R27.2
  Bottom 0.457: v73.41,65.82 72.36,64.77 v48.26,64.77
(copper drawn outside any net)
  shapes: Top area x1

### Text on the board
Top: En timer att sämja dem, / en timer att främja dem, | en timer att djupt i mörkrets / vida riken tämja dem